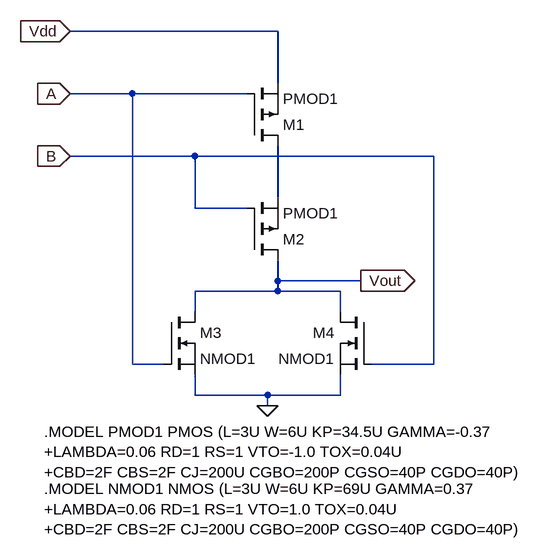
[diagram p0: schematic nor_gate.asc]
nor_gate.asc, the LTspice schematic file:
Version 4
SHEET 1 880 712
WIRE 192 -64 -128 -64
WIRE 192 16 192 -64
WIRE -32 32 -128 32
WIRE 144 32 -32 32
WIRE 64 128 -128 128
WIRE 432 128 64 128
WIRE 192 192 192 112
WIRE 64 208 64 128
WIRE 144 208 64 208
WIRE 192 320 192 288
WIRE 320 320 192 320
WIRE 192 336 192 320
WIRE 192 336 64 336
WIRE 288 336 192 336
WIRE 64 368 64 336
WIRE 288 368 288 336
WIRE -32 448 -32 32
WIRE 16 448 -32 448
WIRE 432 448 432 128
WIRE 432 448 336 448
WIRE 64 496 64 464
WIRE 176 496 64 496
WIRE 288 496 288 464
WIRE 288 496 176 496
WIRE 176 512 176 496
FLAG -128 32 A
IOPIN -128 32 In
FLAG -128 128 B
IOPIN -128 128 In
FLAG -128 -64 Vdd
IOPIN -128 -64 In
FLAG 320 320 Vout
IOPIN 320 320 Out
FLAG 176 512 0
SYMBOL pmos 144 112 M180
SYMATTR InstName M1
SYMATTR Value PMOD1
SYMBOL pmos 144 288 M180
SYMATTR InstName M2
SYMATTR Value PMOD1
SYMBOL nmos 16 368 R0
SYMATTR InstName M3
SYMATTR Value NMOD1
SYMBOL nmos 336 368 M0
SYMATTR InstName M4
SYMATTR Value NMOD1
TEXT -168 552 Left 2 !.MODEL PMOD1 PMOS (L=3U W=6U KP=34.5U GAMMA=-0.37\n+LAMBDA=0.06 RD=1 RS=1 VTO=-1.0 TOX=0.04U\n+CBD=2F CBS=2F CJ=200U CGBO=200P CGSO=40P CGDO=40P)
TEXT -168 640 Left 2 !.MODEL NMOD1 NMOS (L=3U W=6U KP=69U GAMMA=0.37\n+LAMBDA=0.06 RD=1 RS=1 VTO=1.0 TOX=0.04U\n+CBD=2F CBS=2F CJ=200U CGBO=200P CGSO=40P CGDO=40P)

The netlist it stands for:
* nor_gate.asc
M1 N001 A Vdd Vdd PMOD1
M2 Vout B N001 N001 PMOD1
M3 Vout A 0 0 NMOD1
M4 Vout B 0 0 NMOD1
.model NMOS NMOS
.model PMOS PMOS
.lib standard.mos
.MODEL PMOD1 PMOS (L=3U W=6U KP=34.5U GAMMA=-0.37
+LAMBDA=0.06 RD=1 RS=1 VTO=-1.0 TOX=0.04U
+CBD=2F CBS=2F CJ=200U CGBO=200P CGSO=40P CGDO=40P)
.MODEL NMOD1 NMOS (L=3U W=6U KP=69U GAMMA=0.37
+LAMBDA=0.06 RD=1 RS=1 VTO=1.0 TOX=0.04U
+CBD=2F CBS=2F CJ=200U CGBO=200P CGSO=40P CGDO=40P)
.backanno
.end